# EAGLE schematic dr1_h (EAGLE 6.4)
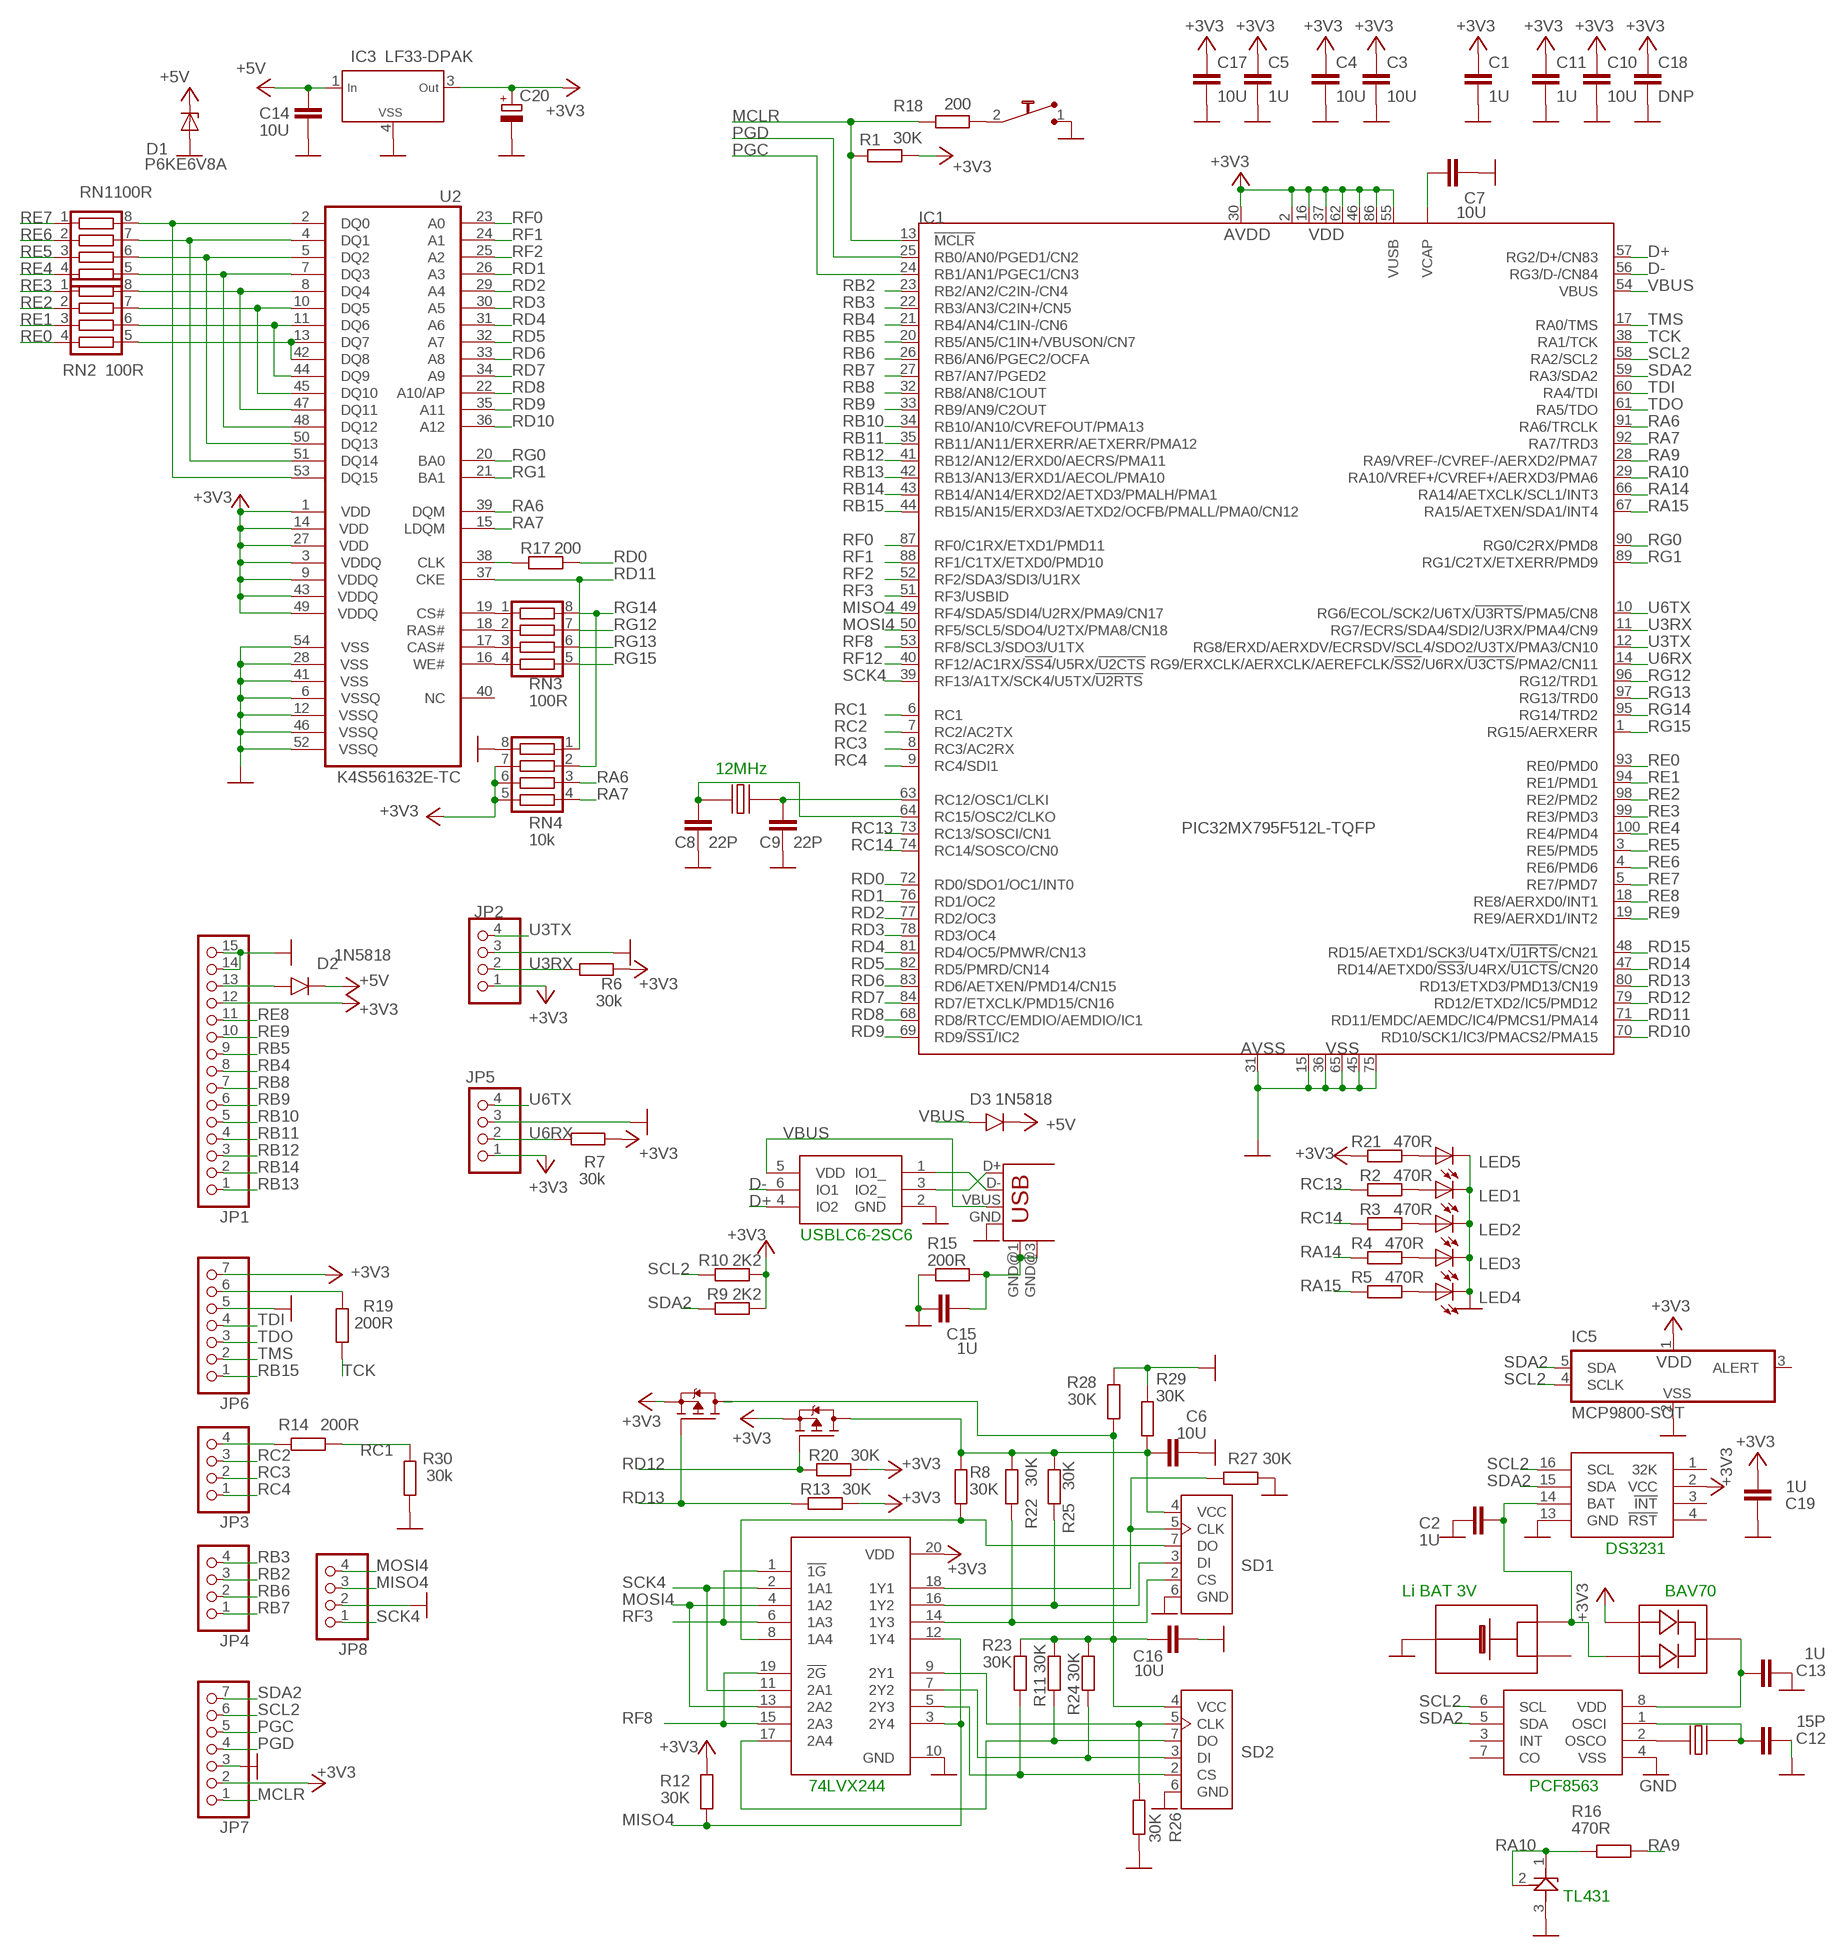
[diagram p0: schematic, sheet 1]

## Parts
1  WE_TVS_2USB  [SOT23-6]
B1  BATT_3001  [BATT_KEYS3001]
C1  1U  C_0806  [R0805]
C2  1U  C_0806  [R0805]
C3  10U  C_0806  [R0805]
C4  10U  C_0806  [R0805]
C5  1U  C_0806  [R0805]
C6  10U  C_0806  [R0805]
C7  10U  C_0806  [R0805]
C8  22P  C_0603  [0603]
C9  22P  C_0603  [0603]
C10  10U  C_0806  [R0805]
C11  1U  C_0806  [R0805]
C12  15P  C_0806  [R0805]
C13  1U  C_0806  [R0805]
C14  10U  C_0806  [R0805]
C15  1U  C_0603  [0603]
C16  10U  C_0806  [R0805]
C17  10U  C_0806  [R0805]
C18  DNP  C_0806  [R0805]
C19  1U  C_0603  [0603]
C20  CPOL-EUSMCB  [SMC_B]
D1  P6KE6V8A  ZENER-DIODESMB  [SMB]
D2  1N5818  1N4007-SM  [SM-1]
D3  1N5818  1N4007-SM  [SM-1]
IC1  PIC32MX795F512L-TQFP  [TQFP100]
IC2  74244TSSOP20  [TSSOP20]
IC3  LF33-DPAK  [DPAK]
IC4  PCF8563_SO8  [SO-08]
IC5  MCP9800-SOT  [SOT23-5L]
JP1  PINHD-1X15_2.54-S  [1X15-S]
JP2  PINHD-1X04_2.54-S  [1X04-S]
JP3  PINHD-1X04_2.54-S  [1X04-S]
JP4  PINHD-1X04_2.54-S  [1X04-S]
JP5  PINHD-1X04_2.54-S  [1X04-S]
JP6  PINHD-1X07_2.54-S  [1X07-S]
JP7  PINHD-1X07_2.54-S  [1X07-S]
JP8  PINHD-1X04_2.54-S  [1X04-S]
LED1  LEDCHIPLED_0603  [CHIPLED_0603]
LED2  LEDCHIPLED_0603  [CHIPLED_0603]
LED3  LEDCHIPLED_0603  [CHIPLED_0603]
LED4  LEDCHIPLED_0603  [CHIPLED_0603]
LED5  LEDCHIPLED_0603  [CHIPLED_0603]
R1  30K  R_0603  [0603]
R2  470R  R_0603  [0603]
R3  470R  R_0603  [0603]
R4  470R  R_0603  [0603]
R5  470R  R_0603  [0603]
R6  30k  R_0603  [0603]
R7  30k  R_0603  [0603]
R8  30K  R_0603  [0603]
R9  2K2  R_0603  [0603]
R10  2K2  R_0603  [0603]
R11  30K  R_0603  [0603]
R12  30K  R_0603  [0603]
R13  30K  R_0603  [0603]
R14  200R  R_0603  [0603]
R15  200R  R_0603  [0603]
R16  470R  R_0603  [0603]
R17  200  R_0603  [0603]
R18  200  R_0603  [0603]
R19  200R  R_0603  [0603]
R20  30K  R_0603  [0603]
R21  470R  R_0603  [0603]
R22  30K  R_0603  [0603]
R23  30K  R_0603  [0603]
R24  30K  R_0603  [0603]
R25  30K  R_0603  [0603]
R26  30K  R_0603  [0603]
R27  30K  R_0603  [0603]
R28  30K  R_0603  [0603]
R29  30K  R_0603  [0603]
R30  30k  R_0603  [0603]
RN1  100R  CTS742C083  [CTS742C083]
RN2  100R  CTS742C083  [CTS742C083]
RN3  100R  CTS742C083  [CTS742C083]
RN4  10k  CTS742C083  [CTS742C083]
SD1  SF-MICROSD  [MICROSD]
SD2  SF-MICROSD  [MICROSD]
T1  SI2333  [SOT23-3]
U2  K4S561632E-TC  [TSOP54]
U$1  TL431_SOT23  [SOT23]
U$2  DS3231  [SO-16]
U$6  BAV70  [SOT23]
U$8  SWITCH_MINI  [SW_SMD_MINI]
U$12  SI2333  [SOT23-3]
USB1  USB-MB-S  [USB-MB-S]
X1  32768  CRYST_TC26TC38  [TC38]
X2  12MHz  CRYST_TC26TC38  [TC38]

## Nets
+3V3: C1.1 C3.1 C4.1 C5.1 C10.1 C11.1 C17.1 C18.1 C19.2 C20.+ IC1.2(VDD1) IC1.16(VDD2) IC1.30(AVDD) IC1.37(VDD3) IC1.46(VDD4) IC1.55(VUSB) IC1.62(VDD) IC1.86(VDD5) IC2.20(VDD) IC3.3(OUT) IC5.1(VDD) JP1.12 JP2.1 JP5.1 JP6.7 JP7.2 R1.2 R6.1 R7.1 R9.2 R10.2 R12.2 R13.1 R20.2 R21.1 RN4.5 RN4.6 RN4.7 T1.2(S) U2.1(VDD) U2.3(VDDQ) U2.9(VDDQ) U2.14(VDD) U2.27(VDD) U2.43(VDDQ) U2.49(VDDQ) U$2.2(VCC) U$6.1(A1) U$12.2(S)
+5V: C14.1 D1.C D2.K D3.K IC3.1(IN)
D+: 1.4(IO2) IC1.57(RG2/D+/CN83)
D-: 1.6(IO1) IC1.56(RG3/D-/CN84)
GND: 1.2(GND) B1.NEG C1.2 C2.2 C3.2 C4.2 C5.2 C6.2 C7.2 C8.2 C9.2 C10.2 C11.2 C12.2 C13.2 C14.2 C15.1 C16.2 C17.2 C18.2 C19.1 C20.- D1.A IC1.15(VSS1) IC1.31(AVSS) IC1.36(VSS2) IC1.45(VSS3) IC1.65(VSS) IC1.75(VSS4) IC2.10(GND) IC3.4(VSS) IC4.4(VSS) IC5.2(VSS) JP1.14 JP1.15 JP2.3 JP5.3 JP6.5 JP7.3 JP8.2 LED1.C LED2.C LED3.C LED4.C LED5.C R15.1 R26.1 R27.1 R28.1 R29.1 R30.1 RN4.8 SD1.6(GND) SD2.6(GND) U2.6(VSSQ) U2.12(VSSQ) U2.28(VSS) U2.41(VSS) U2.46(VSSQ) U2.52(VSSQ) U2.54(VSS) U$1.3(A) U$2.13(GND) U$8.1 USB1.GND
MCLR: IC1.13(!MCLR) JP7.1 R1.1 R18.1
MISO4: IC1.49(RF4/SDA5/SDI4/U2RX/PMA9/CN17) IC2.3(2Y4) IC2.12(1Y4) JP8.3 R12.1
MOSI4: IC1.50(RF5/SCL5/SDO4/U2TX/PMA8/CN18) IC2.4(1A2) IC2.13(2A2) JP8.4
N$4: C9.1 IC1.63(RC12/OSC1/CLKI) X2.P$2
N$5: JP6.6 R19.2
N$7: IC4.2(OSCO) X1.P$1
N$8: IC2.18(1Y1) R27.2 SD1.5(CLK)
N$9: IC2.16(1Y2) R25.2 SD1.3(DI)
N$10: C12.1 IC4.1(OSCI) X1.P$2
N$11: LED1.A R2.2
N$12: LED2.A R3.2
N$13: LED3.A R4.2
N$14: LED4.A R5.2
N$15: C13.1 IC4.8(VDD) U$6.3(C)
N$16: B1.POS2 C2.1 U$2.14(BAT) U$6.2(A2)
N$17: C15.2 R15.2 USB1.GND@1(GND) USB1.GND@3(GND)
N$18: D2.A JP1.13
N$19: C8.1 IC1.64(RC15/OSC2/CLKO) X2.P$1
N$20: RN2.5 U2.13(DQ7) U2.42(DQ8)
N$21: RN2.6 U2.11(DQ6) U2.44(DQ9)
N$22: RN2.7 U2.10(DQ5) U2.45(DQ10)
N$23: RN2.8 U2.8(DQ4) U2.47(DQ11)
N$24: RN1.5 U2.7(DQ3) U2.48(DQ12)
N$25: RN1.6 U2.5(DQ2) U2.50(DQ13)
N$26: RN1.7 U2.4(DQ1) U2.51(DQ14)
N$27: RN1.8 U2.2(DQ0) U2.53(DQ15)
N$28: RN3.2 U2.18(RAS#)
N$29: RN3.3 U2.17(CAS#)
N$30: RN3.4 U2.16(WE#)
N$31: RN3.1 U2.19(CS#)
N$32: R18.2 U$8.2
N$33: R17.1 U2.38(CLK)
N$34: IC2.14(1Y3) R22.1 SD1.2(CS)
N$35: IC2.8(1A4) R8.2 SD1.7(DO)
N$36: IC2.9(2Y1) R26.2 SD2.5(CLK)
N$37: C7.1 IC1.85(VCAP)
N$38: IC2.7(2Y2) R24.1 SD2.3(DI)
N$39: IC2.5(2Y3) R23.1 SD2.2(CS)
N$40: 1.1(IO1_) USB1.D-
N$41: LED5.A R21.2
N$42: JP3.4 R14.2
N$43: IC2.17(2A4) R11.1 SD2.7(DO)
N$44: 1.3(IO2_) USB1.D+
N$48: C6.1 R8.1 R22.2 R25.1 R29.2 SD1.4(VCC) U$12.3(D)
N$49: C16.1 R11.2 R23.2 R24.2 R28.2 SD2.4(VCC) T1.3(D)
PGC: IC1.24(RB1/AN1/PGEC1/CN3) JP7.5
PGD: IC1.25(RB0/AN0/PGED1/CN2) JP7.4
RA6: IC1.91(RA6/TRCLK) RN4.3 U2.39(DQM)
RA7: IC1.92(RA7/TRD3) RN4.4 U2.15(LDQM)
RA9: IC1.28(RA9/VREF-/CVREF-/AERXD2/PMA7) R16.2
RA10: IC1.29(RA10/VREF+/CVREF+/AERXD3/PMA6) R16.1 U$1.1(C) U$1.2(R)
RA14: IC1.66(RA14/AETXCLK/SCL1/INT3) R4.1
RA15: IC1.67(RA15/AETXEN/SDA1/INT4) R5.1
RB2: IC1.23(RB2/AN2/C2IN-/CN4) JP4.3
RB3: IC1.22(RB3/AN3/C2IN+/CN5) JP4.4
RB4: IC1.21(RB4/AN4/C1IN-/CN6) JP1.8
RB5: IC1.20(RB5/AN5/C1IN+/VBUSON/CN7) JP1.9
RB6: IC1.26(RB6/AN6/PGEC2/OCFA) JP4.2
RB7: IC1.27(RB7/AN7/PGED2) JP4.1
RB8: IC1.32(RB8/AN8/C1OUT) JP1.7
RB9: IC1.33(RB9/AN9/C2OUT) JP1.6
RB10: IC1.34(RB10/AN10/CVREFOUT/PMA13) JP1.5
RB11: IC1.35(RB11/AN11/ERXERR/AETXERR/PMA12) JP1.4
RB12: IC1.41(RB12/AN12/ERXD0/AECRS/PMA11) JP1.3
RB13: IC1.42(RB13/AN13/ERXD1/AECOL/PMA10) JP1.1
RB14: IC1.43(RB14/AN14/ERXD2/AETXD3/PMALH/PMA1) JP1.2
RB15: IC1.44(RB15/AN15/ERXD3/AETXD2/OCFB/PMALL/PMA0/CN12) JP6.1
RC1: IC1.6(RC1) R14.1 R30.2
RC2: IC1.7(RC2/AC2TX) JP3.3
RC3: IC1.8(RC3/AC2RX) JP3.2
RC4: IC1.9(RC4/SDI1) JP3.1
RC13: IC1.73(RC13/SOSCI/CN1) R2.1
RC14: IC1.74(RC14/SOSCO/CN0) R3.1
RD0: IC1.72(RD0/SDO1/OC1/INT0) R17.2
RD1: IC1.76(RD1/OC2) U2.26(A3)
RD2: IC1.77(RD2/OC3) U2.29(A4)
RD3: IC1.78(RD3/OC4) U2.30(A5)
RD4: IC1.81(RD4/OC5/PMWR/CN13) U2.31(A6)
RD5: IC1.82(RD5/PMRD/CN14) U2.32(A7)
RD6: IC1.83(RD6/AETXEN/PMD14/CN15) U2.33(A8)
RD7: IC1.84(RD7/ETXCLK/PMD15/CN16) U2.34(A9)
RD8: IC1.68(RD8/RTCC/EMDIO/AEMDIO/IC1) U2.22(A10/AP)
RD9: IC1.69(RD9/!SS1!/IC2) U2.35(A11)
RD10: IC1.70(RD10/SCK1/IC3/PMACS2/PMA15) U2.36(A12)
RD11: IC1.71(RD11/EMDC/AEMDC/IC4/PMCS1/PMA14) RN4.1 U2.37(CKE)
RD12: IC1.79(RD12/ETXD2/IC5/PMD12) R20.1 U$12.1(G)
RD13: IC1.80(RD13/ETXD3/PMD13/CN19) R13.2 T1.1(G)
RD14: IC1.47(RD14/AETXD0/!SS3!/U4RX/!U1CTS!/CN20)
RD15: IC1.48(RD15/AETXD1/SCK3/U4TX/!U1RTS!/CN21)
RE0: IC1.93(RE0/PMD0) RN2.4
RE1: IC1.94(RE1/PMD1) RN2.3
RE2: IC1.98(RE2/PMD2) RN2.2
RE3: IC1.99(RE3/PMD3) RN2.1
RE4: IC1.100(RE4/PMD4) RN1.4
RE5: IC1.3(RE5/PMD5) RN1.3
RE6: IC1.4(RE6/PMD6) RN1.2
RE7: IC1.5(RE7/PMD7) RN1.1
RE8: IC1.18(RE8/AERXD0/INT1) JP1.11
RE9: IC1.19(RE9/AERXD1/INT2) JP1.10
RF0: IC1.87(RF0/C1RX/ETXD1/PMD11) U2.23(A0)
RF1: IC1.88(RF1/C1TX/ETXD0/PMD10) U2.24(A1)
RF2: IC1.52(RF2/SDA3/SDI3/U1RX) U2.25(A2)
RF3: IC1.51(RF3/USBID) IC2.1(!1G) IC2.6(1A3)
RF8: IC1.53(RF8/SCL3/SDO3/U1TX) IC2.15(2A3) IC2.19(!2G)
RF12: IC1.40(RF12/AC1RX/!SS4!/U5RX/!U2CTS)
RG0: IC1.90(RG0/C2RX/PMD8) U2.20(BA0)
RG1: IC1.89(RG1/C2TX/ETXERR/PMD9) U2.21(BA1)
RG12: IC1.96(RG12/TRD1) RN3.7
RG13: IC1.97(RG13/TRD0) RN3.6
RG14: IC1.95(RG14/TRD2) RN3.8 RN4.2
RG15: IC1.1(RG15/AERXERR) RN3.5
SCK4: IC1.39(RF13/A1TX/SCK4/U5TX/!U2RTS) IC2.2(1A1) IC2.11(2A1) JP8.1
SCL2: IC1.58(RA2/SCL2) IC4.6(SCL) IC5.4(SCLK) JP7.6 R10.1 U$2.16(SCL)
SDA2: IC1.59(RA3/SDA2) IC4.5(SDA) IC5.5(SDA) JP7.7 R9.1 U$2.15(SDA)
TCK: IC1.38(RA1/TCK) R19.1
TDI: IC1.60(RA4/TDI) JP6.4
TDO: IC1.61(RA5/TDO) JP6.3
TMS: IC1.17(RA0/TMS) JP6.2
U3RX: IC1.11(RG7/ECRS/SDA4/SDI2/U3RX/PMA4/CN9) JP2.2 R6.2
U3TX: IC1.12(RG8/ERXD/AERXDV/ECRSDV/SCL4/SDO2/U3TX/PMA3/CN10) JP2.4
U6RX: IC1.14(RG9/ERXCLK/AERXCLK/AEREFCLK/!SS2!/U6RX/!U3CTS!/PMA2/CN11) JP5.2 R7.2
U6TX: IC1.10(RG6/ECOL/SCK2/U6TX/!U3RTS!/PMA5/CN8) JP5.4
VBUS: 1.5(VDD) D3.A IC1.54(VBUS) USB1.VBUS
Unconnected: B1.POS1 IC4.3(INT) IC4.7(CO) IC5.3(ALERT) U2.40(NC) U$2.1(32K) U$2.3(!INT) U$2.4(!RST)

## Notes on the sheet
- 12MHz
- USBLC6-2SC6
- DS3231
- Li BAT 3V | BAV70
- 74LVX244 | PCF8563
- TL431

## Library data of the parts
1 = _moja:WE_TVS_2USB
B1 = _moja:BATT_3001
C1-C19 = _moja:C
C20 = _rcl:CPOL-EU: POLARIZED CAPACITOR, European symbol
D1 = diode:ZENER-DIODE: Z-Diode
D2 D3 = _mcom4:1N4007
IC1 = _mcom4:PIC32MX795F512L
IC2 = _mcom4:74244
IC3 = _mcom4:LF33
IC4 = _mcom4:PCF8563
IC5 = _mcom5:MCP9800
JP1 = pinhead-2:PINHD-1X15: PIN HEADER
JP2-JP5 JP8 = pinhead-2:PINHD-1X04: PIN HEADER
JP6 JP7 = pinhead-2:PINHD-1X07: PIN HEADER
LED1-LED5 = led:LED: LED OSRAM: - CHIPLED LG R971, LG N971, LY N971, LG Q971, LY Q971, LO R971, LY R971 LH N974, LH R974 LS Q976, LO Q976, LY Q976 LO Q996 - Hyper CHIPLED LW Q18S LB Q993, LB Q99A, LB R99A - SideLED LS A670, LO A670, LY A670, LG A670, LP A670 LB A673, LV A673, LT A673, LW A673 LH A674 LY A675 LS A676, LA A676, LO A676, LY A676, LW A676 LS A679, LY A679, LG A679 - Hyper Micro SIDELED® LS Y876, LA Y876, LO Y876, LY Y876 LT Y87S - SmartLED LW L88C, LW L88S LB L89C, LB L89S, LG L890 LS L89K, LO L89K, LY L89K LS L896, LA L896, LO L896, LY L896 - TOPLED LS T670, LO T670, LY T670, LG T670, LP T670 LSG T670, LSP T670, LSY T670, LOP T670, LYG T670 LG T671, LOG T671, LSG T671 LB T673, LV T673, LT T673, LW T673 LH T674 LS T676, LA T676, LO T676, LY T676, LB T676, LH T676, LSB T676, LW T676 LB T67C, LV T67C, LT T67C, LS T67K, LO T67K, LY T67K, LW E67C LS E67B, LA E67B, LO E67B, LY E67B, LB E67C, LV E67C, LT E67C LW T67C LS T679, LY T679, LG T679 LS T770, LO T770, LY T770, LG T770, LP T770 LB T773, LV T773, LT T773, LW T773 LH T774 LS E675, LA E675, LY E675, LS T675 LS T776, LA T776, LO T776, LY T776, LB T776 LHGB T686 LT T68C, LB T68C - Hyper Mini TOPLED® LB M676 - Mini TOPLED Santana® LG M470 LS M47K, LO M47K, LY M47K Source: http://www.osram.convergy.de LUXEON: - LUMILED® LXK2-PW12-R00, LXK2-PW12-S00, LXK2-PW14-U00, LXK2-PW14-V00 LXK2-PM12-R00, LXK2-PM12-S00, LXK2-PM14-U00 LXK2-PE12-Q00, LXK2-PE12-R00, LXK2-PE12-S00, LXK2-PE14-T00, LXK2-PE14-U00 LXK2-PB12-K00, LXK2-PB12-L00, LXK2-PB12-M00, LXK2-PB14-N00, LXK2-PB14-P00, LXK2-PB14-Q00 LXK2-PR12-L00, LXK2-PR12-M00, LXK2-PR14-Q00, LXK2-PR14-R00 LXK2-PD12-Q00, LXK2-PD12-R00, LXK2-PD12-S00 LXK2-PH12-R00, LXK2-PH12-S00 LXK2-PL12-P00, LXK2-PL12-Q00, LXK2-PL12-R00 Source: www.luxeon.com KINGBRIGHT: KA-3528ASYC Source: www.kingbright.com
R1-R30 = _moja:R
RN1-RN4 = resistor-net:CTS742C083: Chip Resistor Array 4 Single Resistor Source: http://www.ctscorp.com/components/Datasheets/CTSChipArrayDs.pdf
SD1 SD2 = microsd:SF-MICROSD
T1 U$12 = _moja:SI2333
U2 = sdram:K4S561632E-TC: SDRAM 4M x 16bit x 4 banks synchronous DRAM. 256 Mbit SDRAM.
U$1 = _mcom5:TL431
U$2 = _mcom5:DS3231
U$6 = _mcom4:BAV70
U$8 = _moja:SWITCH_MINI
USB1 = con-usb-2:USB: USB Connectors
X1 X2 = _moja:CRYST_TC26